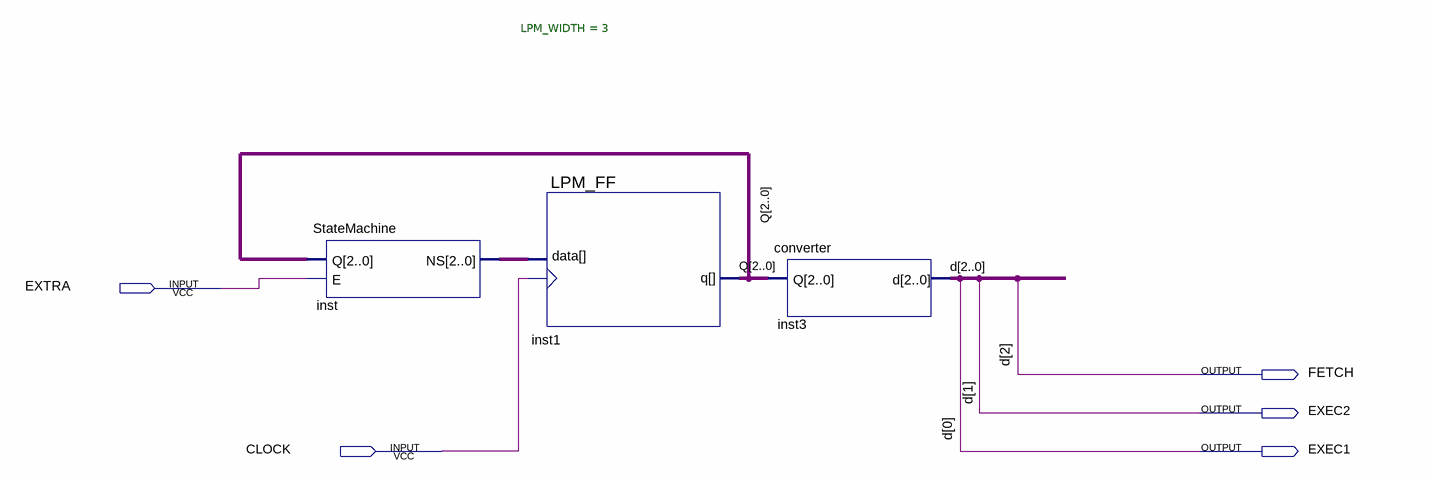
[diagram p0: schematic sheet]
// Quartus schematic StateMchn.bdf as structural Verilog: 3 symbols, 5 pins
module StateMchn (
  input  EXTRA,
  input  CLOCK,
  output FETCH,
  output EXEC2,
  output EXEC1
);

  wire [2:0] inst_ns, Q;

  StateMachine inst (.Q(Q), .E(EXTRA), .NS(inst_ns));
  LPM_FF #(.LPM_WIDTH(3)) inst1 (.clock(CLOCK), .data(inst_ns), .q(Q));
  converter inst3 (.Q(Q), .d({FETCH, EXEC2, EXEC1}));

  // Other names for the same wires on the sheet: d[2:0] = {FETCH, EXEC2, EXEC1}
endmodule
